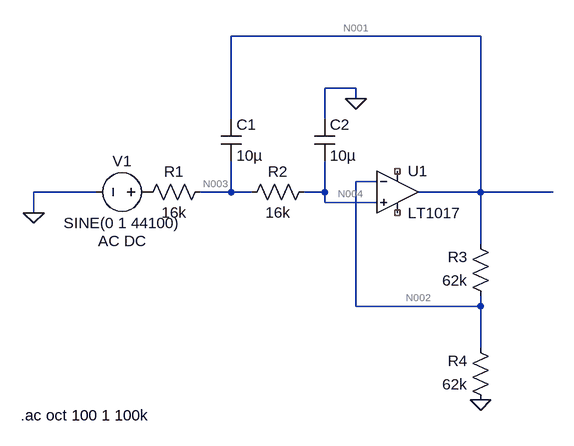
[diagram p0: schematic Draft1.asc]
Draft1.asc, the LTspice schematic file:
Version 4
SHEET 1 1936 680
WIRE 560 -80 176 -80
WIRE 368 0 320 0
WIRE 368 16 368 0
WIRE 176 48 176 -80
WIRE 320 48 320 0
WIRE 400 144 368 144
WIRE -32 160 -128 160
WIRE 176 160 176 112
WIRE 176 160 128 160
WIRE 208 160 176 160
WIRE 320 160 320 112
WIRE 320 160 288 160
WIRE 560 160 560 -80
WIRE 560 160 464 160
WIRE 672 160 560 160
WIRE 320 176 320 160
WIRE 400 176 320 176
WIRE -128 192 -128 160
WIRE 560 240 560 160
WIRE 368 336 368 144
WIRE 560 336 560 320
WIRE 560 336 368 336
WIRE 560 400 560 336
FLAG -128 192 0
FLAG 560 480 0
FLAG 368 16 0
SYMBOL voltage 64 160 R90
WINDOW 0 -32 56 VBottom 2
WINDOW 3 32 56 VTop 2
WINDOW 123 60 56 VTop 2
WINDOW 39 0 0 Left 2
SYMATTR InstName V1
SYMATTR Value SINE(0 1 44100)
SYMATTR Value2 AC DC
SYMBOL res 144 144 R90
WINDOW 0 0 56 VBottom 2
WINDOW 3 32 56 VTop 2
SYMATTR InstName R1
SYMATTR Value 16k
SYMBOL cap 160 48 R0
SYMATTR InstName C1
SYMATTR Value 10µ
SYMBOL cap 304 48 R0
SYMATTR InstName C2
SYMATTR Value 10µ
SYMBOL res 304 144 R90
WINDOW 0 0 56 VBottom 2
WINDOW 3 32 56 VTop 2
SYMATTR InstName R2
SYMATTR Value 16k
SYMBOL res 576 336 R180
WINDOW 0 36 76 Left 2
WINDOW 3 36 40 Left 2
SYMATTR InstName R3
SYMATTR Value 62k
SYMBOL res 576 496 R180
WINDOW 0 36 76 Left 2
WINDOW 3 36 40 Left 2
SYMATTR InstName R4
SYMATTR Value 62k
SYMBOL Comparators\\LT1017 432 160 R0
SYMATTR InstName U1
TEXT -148 504 Left 2 !.ac oct 100 1 100k

The netlist it stands for:
* Draft1.asc
V1 P001 0 SINE(0 1 44100) AC DC
R1 N003 P001 16k
C1 N001 N003 10µ
C2 0 N004 10µ
R2 N004 N003 16k
R3 N002 N001 62k
R4 0 N002 62k
XU1 N004 N002 NC_01 NC_02 N001 LT1017  ; pins In+ In- V+ V- OUT
.ac oct 100 1 100k
.backanno
.end

* Results of the author's LTspice run, read from the files saved beside the schematic
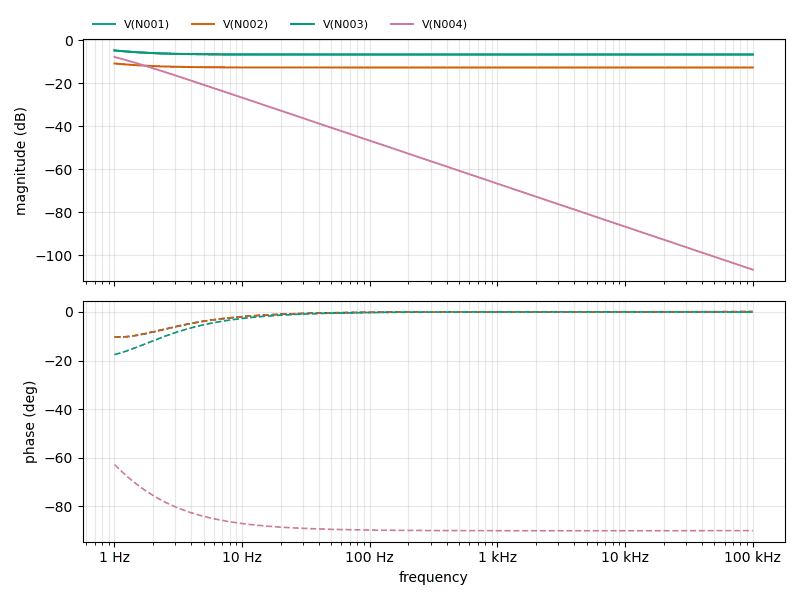
[diagram p1: AC Analysis of Draft1.asc, plotted from the saved traces]
* AC Analysis, 1 run:
*   V(N001): -4.73 dB at 1 Hz, -6.56 dB at 100 kHz, peak -4.73 dB at 1 Hz
*   V(N002): -10.75 dB at 1 Hz, -12.59 dB at 100 kHz, peak -10.75 dB at 1 Hz
*   V(N003): -4.66 dB at 1 Hz, -6.56 dB at 100 kHz, peak -4.66 dB at 1 Hz
*   V(N004): -7.69 dB at 1 Hz, -106.61 dB at 100 kHz, peak -7.69 dB at 1 Hz, 3 dB below the peak at 1.511 Hz